# EAGLE design Micro_V6 (EAGLE 8.4.0)
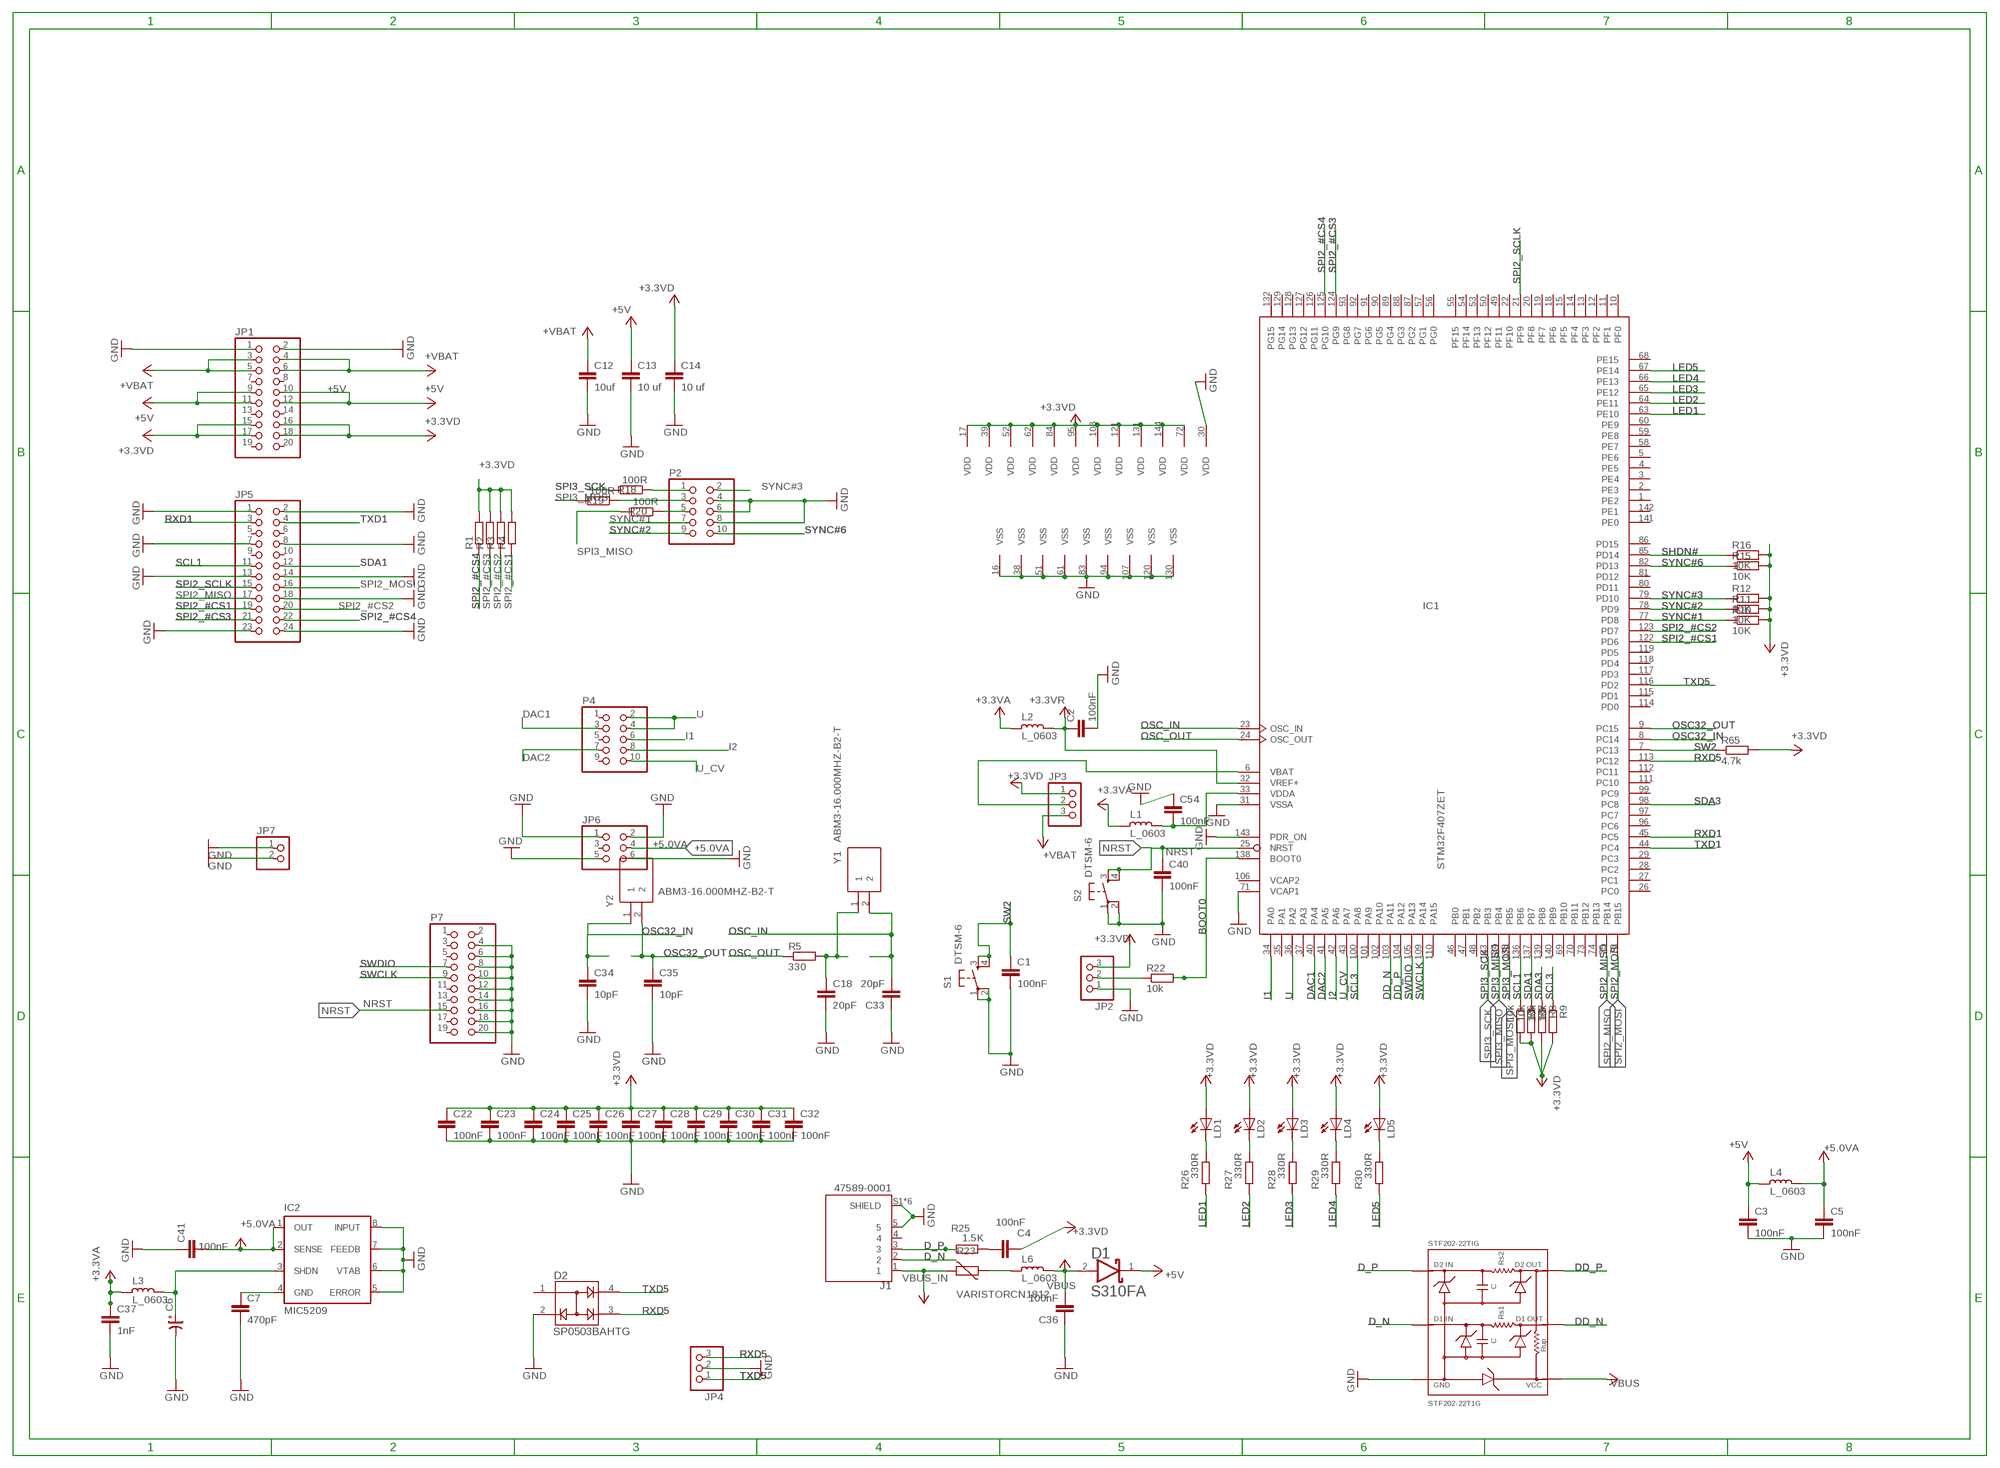
[diagram p0: schematic, sheet 1]

## Parts
C1  100nF  C-EUC0805  [C0805]
C2  100nF  C-EUC0805  [C0805]
C3  100nF  C-EUC0805  [C0805]
C4  100nF  C-EUC0805  [C0805]
C5  100nF  C-EUC0805  [C0805]
C6  CP_SV-A  [CSV-A]
C7  470pF  C-EUC0805  [C0805]
C12  10uf  C-EUC0805K  [C0805K]
C13  10 uf  C-EUC0805K  [C0805K]
C14  10 uf  C-EUC0805K  [C0805K]
C18  20pF  C-EUC0805  [C0805]
C22  100nF  C-EUC0805  [C0805]
C23  100nF  C-EUC0805  [C0805]
C24  100nF  C-EUC0805  [C0805]
C25  100nF  C-EUC0805  [C0805]
C26  100nF  C-EUC0805  [C0805]
C27  100nF  C-EUC0805  [C0805]
C28  100nF  C-EUC0805  [C0805]
C29  100nF  C-EUC0805  [C0805]
C30  100nF  C-EUC0805  [C0805]
C31  100nF  C-EUC0805  [C0805]
C32  100nF  C-EUC0805  [C0805]
C33  20pF  C-EUC0805  [C0805]
C34  10pF  C-EUC0805  [C0805]
C35  10pF  C-EUC0805  [C0805]
C36  100nF  C-EUC0805  [C0805]
C37  1nF  C-EUC0805  [C0805]
C40  100nF  C-EUC0805  [C0805]
C41  100nF  C-EUC0805  [C0805]
C54  100nF  C-EUC0805  [C0805]
D1  ON_SEMICONDUCTOR_S310FAON_SEMICONDUCTOR_S310FA_0_0  [ON_SEMICONDUCTOR_S310FA_0]
D2  SP0503BAHTG  [SOT143]
IC1  STM32F407ZET  [LQFP144]
IC2  MIC5209  LP2951ACM-3.3  [SO-08]
J1  47589-0001  [MOLEX_47589-0001]
JP1  PINHD-2X10  [2X10]
JP2  PINHD-1X3  [1X03]
JP3  PINHD-1X3  [1X03]
JP4  PINHD-1X3  [1X03]
JP5  PINHD-2X12  [2X12]
JP6  PINHD-2X3  [2X03]
JP7  PINHD-1X2  [1X02]
L1  L_0603  [L0603]
L2  L_0603  [L0603]
L3  L_0603  [L0603]
L4  L_0603  [L0603]
L6  L_0603  [L0603]
LD1  LEDSMT1206  [1206]
LD2  LEDSMT1206  [1206]
LD3  LEDSMT1206  [1206]
LD4  LEDSMT1206  [1206]
LD5  LEDSMT1206  [1206]
P2  PINHD-2X5  [2X05]
P4  PINHD-2X5  [2X05]
P7  PINHD-2X10  [2X10]
R1  R-EU_R0603  [R0603]
R2  R-EU_R0603  [R0603]
R3  R-EU_R0603  [R0603]
R4  R-EU_R0603  [R0603]
R5  330  R-EU_R0603  [R0603]
R6  10k  R-EU_R0603  [R0603]
R7  10k  R-EU_R0603  [R0603]
R8  10k  R-EU_R0603  [R0603]
R9  10k  R-EU_R0603  [R0603]
R10  10K  R-EU_R0603  [R0603]
R11  10K  R-EU_R0603  [R0603]
R12  10K  R-EU_R0603  [R0603]
R15  10K  R-EU_R0603  [R0603]
R16  10K  R-EU_R0603  [R0603]
R18  100R  R-EU_R0603  [R0603]
R19  100R  R-EU_R0603  [R0603]
R20  100R  R-EU_R0603  [R0603]
R22  10k  R-EU_R0603  [R0603]
R23  VARISTORCN1812  [CT/CN1812]
R25  1.5K  R-EU_R0603  [R0603]
R26  330R  R-EU_R0603  [R0603]
R27  330R  R-EU_R0603  [R0603]
R28  330R  R-EU_R0603  [R0603]
R29  330R  R-EU_R0603  [R0603]
R30  330R  R-EU_R0603  [R0603]
R65  4.7k  R-EU_R0603  [R0603]
S1  DTSM-6  [DTSM-6]
S2  DTSM-6  [DTSM-6]
STF202-22TIG  STF202-22T1G  [STF202-22T1G]
Y1  ABM3-16.000MHZ-B2-T  [ABM316000MHZB2T]
Y2  ABM3-16.000MHZ-B2-T  [ABM316000MHZB2T]

## Nets
+3.3VA: C37.1 L1.2 L2.2 L3.2
+3.3VD: C4.1 C14.1 C22.1 C23.1 C24.1 C25.1 C26.1 C27.1 C28.1 C29.1 C30.1 C31.1 C32.1 IC1.17(VDD) IC1.39(VDD) IC1.52(VDD) IC1.62(VDD) IC1.72(VDD) IC1.84(VDD) IC1.95(VDD) IC1.108(VDD) IC1.121(VDD) IC1.131(VDD) IC1.144(VDD) JP1.15 JP1.16 JP1.17 JP1.18 JP2.3 JP3.1 LD1.A LD2.A LD3.A LD4.A LD5.A R1.2 R2.2 R3.2 R4.2 R6.2 R7.2 R8.2 R9.2 R10.2 R11.2 R12.2 R15.2 R16.2 R65.2
+3.3VR: C2.1 IC1.32(VREF+) L2.1
+5.0VA: C5.1 C41.2 IC2.1(OUT) IC2.2(SENSE) JP6.4 L4.1
+5V: C3.1 C13.1 D1.1(CATHODE) JP1.9 JP1.10 JP1.11 JP1.12 L4.2
+VBAT: C12.1 JP1.3 JP1.4 JP1.5 JP1.6 JP3.3
BOOT0: IC1.138(BOOT0) R22.2
D_N: J1.2 STF202-22TIG.5(D1-OUT)
D_P: J1.3 R25.1 STF202-22TIG.4(D2-OUT)
DAC1: IC1.40(PA4) P4.3
DAC2: IC1.41(PA5) P4.7
DD_N: IC1.103(PA11) STF202-22TIG.2(D1-IN)
DD_P: IC1.104(PA12) STF202-22TIG.3(D2-IN)
GND: C1.2 C2.2 C3.2 C5.2 C6.- C7.2 C12.2 C13.2 C14.2 C18.2 C22.2 C23.2 C24.2 C25.2 C26.2 C27.2 C28.2 C29.2 C30.2 C31.2 C32.2 C33.1 C34.2 C35.2 C36.1 C37.2 C40.2 C41.1 C54.1 D2.2 IC1.16(VSS) IC1.30(VDD) IC1.31(VSSA) IC1.38(VSS) IC1.51(VSS) IC1.61(VSS) IC1.71(VCAP1) IC1.83(VSS) IC1.94(VSS) IC1.107(VSS) IC1.120(VSS) IC1.130(VSS) IC1.143(PDR_ON) IC2.5(ERROR) IC2.6(VTAB) IC2.7(FEEDB) IC2.8(INPUT) J1.5 J1.S1(SHIELD) J1.S2(SHIELD) J1.S3(SHIELD) J1.S4(SHIELD) J1.S5(SHIELD) J1.S6(SHIELD) JP1.1 JP1.2 JP2.1 JP4.2 JP5.1 JP5.2 JP5.7 JP5.8 JP5.13 JP5.14 JP5.18 JP5.23 JP5.24 JP6.1 JP6.2 JP6.5 JP6.6 JP7.1 JP7.2 P2.4 P2.6 P2.8 P7.4 P7.6 P7.8 P7.10 P7.12 P7.14 P7.16 P7.18 P7.20 S1.1 S1.2 S2.1 S2.2 STF202-22TIG.6(GND)
I1: IC1.34(PA0) P4.6
I2: IC1.42(PA6) P4.8
LED1: IC1.63(PE10) R26.1
LED2: IC1.64(PE11) R27.1
LED3: IC1.65(PE12) R28.1
LED4: IC1.66(PE13) R29.1
LED5: IC1.67(PE14) R30.1
N$1: IC1.6(VBAT) JP3.2
N$2: C54.2 IC1.33(VDDA) L1.1
N$3: P2.3 R19.1
N$4: P2.5 R20.1
N$5: L6.2 R23.1
N$9: P2.1 R18.1
N$15: C18.1 R5.2 Y1.1
N$19: JP2.2 R22.1
N$24: C6.+ IC2.3(SHDN) L3.1
N$26: C7.1 IC2.4(GND)
N$28: C4.2 R25.2
N$29: LD1.C R26.2
N$30: LD2.C R27.2
N$31: LD3.C R28.2
N$32: LD4.C R29.2
N$33: LD5.C R30.2
NRST: C40.1 IC1.25(NRST) P7.15 S2.3 S2.4
OSC32_IN: C34.1 IC1.8(PC14) Y2.1
OSC32_OUT: C35.1 IC1.9(PC15) Y2.2
OSC_IN: C33.2 IC1.23(OSC_IN) Y1.2
OSC_OUT: IC1.24(OSC_OUT) R5.1
RXD1: IC1.45(PC5) JP5.3
RXD5: D2.3 IC1.113(PC12) JP4.3
SCL1: IC1.136(PB6) JP5.11 R6.1
SCL3: IC1.100(PA8) R9.1
SDA1: IC1.137(PB7) JP5.12 R7.1
SDA3: IC1.98(PC8) R8.1
SHDN#: IC1.85(PD14) R16.1
SPI2_#CS1: IC1.122(PD6) JP5.19 R4.1
SPI2_#CS2: IC1.123(PD7) JP5.20 R3.1
SPI2_#CS3: IC1.124(PG9) JP5.21 R2.1
SPI2_#CS4: IC1.125(PG10) JP5.22 R1.1
SPI2_MISO: IC1.75(PB14) JP5.17
SPI2_MOSI: IC1.76(PB15) JP5.16
SPI2_SCLK: IC1.21(PF9) JP5.15
SPI3_MISO: IC1.134(PB4) R20.2
SPI3_MOSI: IC1.135(PB5) R19.2
SPI3_SCK: IC1.133(PB3) R18.2
SW2: C1.1 IC1.7(PC13) R65.1 S1.3 S1.4
SWCLK: IC1.109(PA14) P7.9
SWDIO: IC1.105(PA13) P7.7
SYNC#1: IC1.77(PD8) P2.7 R10.1
SYNC#2: IC1.78(PD9) P2.9 R11.1
SYNC#3: IC1.79(PD10) P2.2 R12.1
SYNC#6: IC1.82(PD13) P2.10 R15.1
TXD1: IC1.44(PC4) JP5.4
TXD5: D2.4 IC1.116(PD2) JP4.1
U: IC1.36(PA2) P4.2 P4.4
U_CV: IC1.43(PA7) P4.10
VBUS: C36.2 D1.2(ANODE) L6.1 STF202-22TIG.1(VCC)
VBUS_IN: J1.1 R23.2
Unconnected: D2.1 IC1.1(PE2) IC1.2(PE3) IC1.3(PE4) IC1.4(PE5) IC1.5(PE6) IC1.10(PF0) IC1.11(PF1) IC1.12(PF2) IC1.13(PF3) IC1.14(PF4) IC1.15(PF5) IC1.18(PF6) IC1.19(PF7) IC1.20(PF8) IC1.22(PF10) IC1.26(PC0) IC1.27(PC1) IC1.28(PC2) IC1.29(PC3) IC1.35(PA1) IC1.37(PA3) IC1.46(PB0) IC1.47(PB1) IC1.48(PB2) IC1.49(PF11) IC1.50(PF12) IC1.53(PF13) IC1.54(PF14) IC1.55(PF15) IC1.56(PG0) IC1.57(PG1) IC1.58(PE7) IC1.59(PE8) IC1.60(PE9) IC1.68(PE15) IC1.69(PB10) IC1.70(PB11) IC1.73(PB12) IC1.74(PB13) IC1.80(PD11) IC1.81(PD12) IC1.86(PD15) IC1.87(PG2) IC1.88(PG3) IC1.89(PG4) IC1.90(PG5) IC1.91(PG6) IC1.92(PG7) IC1.93(PG8) IC1.96(PC6) IC1.97(PC7) IC1.99(PC9) IC1.101(PA9) IC1.102(PA10) IC1.110(PA15) IC1.111(PC10) IC1.112(PC11) IC1.114(PD0) IC1.115(PD1) IC1.117(PD3) IC1.118(PD4) IC1.119(PD5) IC1.126(PG11) IC1.127(PG12) IC1.128(PG13) IC1.129(PG14) IC1.132(PG15) IC1.139(PB8) IC1.140(PB9) IC1.141(PE0) IC1.142(PE1) J1.4 JP1.7 JP1.8 JP1.13 JP1.14 JP1.19 JP1.20 JP5.5 JP5.6 JP5.9 JP5.10 JP6.3 P4.1 P4.5 P4.9 P7.1 P7.2 P7.3 P7.5 P7.11 P7.13 P7.17 P7.19

## Power pins joined to a net without a drawn wire
VCAP2: IC1.106(VCAP2)

## Library data of the parts
C1-C5 C7 C12-C14 C18 C22-C37 C40 C41 C54 = rcl:C-EU: CAPACITOR, European symbol; SPICEPREFIX: C
C6 = rc-master-smd:CP_: POLARIZED CAP
D1 = ON Semiconductor - S310FA:ON_SEMICONDUCTOR_S310FA: DIODE SCHOTTKY 100V 3A SOD123FA; AUTOMOTIVE: No; CAPACITANCE: 78pF; CENTROID_NOT_SPECIFIED: No; DATASHEET: https://www.onsemi.com/pub/Collateral/SS36FA-D.PDF; DEVICE_CLASS_L1: Discrete Semiconductors; DEVICE_CLASS_L2: Diodes; DEVICE_CLASS_L3: Schottky Diodes; DIGIKEY_DESCRIPTION: DIODE SCHOTTKY 100V 3A SOD123FA; DIGIKEY_PART_NUMBER: S310FACT-ND; FOOTPRINT_URL: https://www.onsemi.com/pub/Collateral/425AB.PDF; FOOTPRINT_VARIANT_NAME_0: Recommended_Land_Pattern; FORWARD_CURRENT: 3A; HEIGHT: 1.43mm; LEAD_FREE: Yes; MAX_JUNCTION_TEMP: +150°C; MAX_REPETITIVE_REVERSE_VOLTAGE: 100V; MAX_SURGE_FORWARD_CURRENT: 80A; MF: ON Semiconductor; MFG_PACKAGE_IDENT: 425AB; MFG_PACKAGE_IDENT_COMPONENT_ID: dabe0bdd8accd792; MFG_PACKAGE_IDENT_DATE: 08/2016; MFG_PACKAGE_IDENT_REV: O; MOUSER_DESCRIPTION: Schottky Diodes & Rectifiers 100V 3A Schottky Barrier Rectifier; MOUSER_PART_NUMBER: 512-S310FA; MPN: S310FA; PACKAGE: SOD-123FL; PEAK_REVERSE_CURRENT: 0.1mA; PREFIX: D; REVERSE_VOLTAGE: 100V; ROHS: Yes; TEMPERATURE_RANGE_HIGH: +150°C; TEMPERATURE_RANGE_LOW: -55°C; VERIFICATION_VERSION: 0.0.0.3
D2 = SP0503BAHTG:SP0503BAHTG: TVS DIODE 5.5VWM 8.5VC SOT143 Check prices <https://pricing.snapeda.com/parts/SP0503BAHTG/Littelfuse%20Inc./view-part?ref=eda>; AVAILABILITY: Warning; DESCRIPTION: 8.5V Clamp Ipp Tvs Diode Surface Mount SOT-143-4; MF: Littelfuse Inc.; MP: SP0503BAHTG; PACKAGE: SOT-143 Littelfuse; PRICE: None; PURCHASE-URL: https://pricing.snapeda.com/search/part/SP0503BAHTG/?ref=eda
IC1 = micro-stm_v3:STM32F407Z*T: ARM 32-bit Cortex™-M3 CPU 168 MHz maximum frequency 512 to 1024 Kbytes of Flash memory 192 kbytes of SRAM 114 GPIOs 1.8 to 3.6 V application supply
IC2 = v-reg:LP2951?*: Series of Adjustable Micropower Voltage Regulators Source: http://cache.national.com/ds/LP/LP2950.pdf
J1 = 47589-0001 (1):47589-0001: Stainless Steel Extractor for Camera Socket, 6.5x6.5 Type, Lead free Check prices <https://pricing.snapeda.com/parts/47589-0001/Molex/view-part?ref=eda>; AVAILABILITY: Warning; DESCRIPTION: USB - micro AB Receptacle Connector 5 Position Surface Mount, Right Angle; Through Hole; MF: Molex; MP: 47589-0001; PACKAGE: None; PRICE: None; PURCHASE-URL: https://pricing.snapeda.com/search/part/47589-0001/?ref=eda
JP1 P7 = pinhead:PINHD-2X10: PIN HEADER
JP2-JP4 = pinhead:PINHD-1X3: PIN HEADER
JP5 = pinhead:PINHD-2X12: PIN HEADER
JP6 = pinhead:PINHD-2X3: PIN HEADER
JP7 = pinhead:PINHD-1X2: PIN HEADER
L1-L4 L6 = rc-master-smd:L_: INDUCTOR
LD1-LD5 = led:LED: LED OSRAM: - CHIPLED LG R971, LG N971, LY N971, LG Q971, LY Q971, LO R971, LY R971 LH N974, LH R974 LS Q976, LO Q976, LY Q976 LO Q996 - Hyper CHIPLED LW Q18S LB Q993, LB Q99A, LB R99A - SideLED LS A670, LO A670, LY A670, LG A670, LP A670 LB A673, LV A673, LT A673, LW A673 LH A674 LY A675 LS A676, LA A676, LO A676, LY A676, LW A676 LS A679, LY A679, LG A679 - Hyper Micro SIDELED® LS Y876, LA Y876, LO Y876, LY Y876 LT Y87S - SmartLED LW L88C, LW L88S LB L89C, LB L89S, LG L890 LS L89K, LO L89K, LY L89K LS L896, LA L896, LO L896, LY L896 - TOPLED LS T670, LO T670, LY T670, LG T670, LP T670 LSG T670, LSP T670, LSY T670, LOP T670, LYG T670 LG T671, LOG T671, LSG T671 LB T673, LV T673, LT T673, LW T673 LH T674 LS T676, LA T676, LO T676, LY T676, LB T676, LH T676, LSB T676, LW T676 LB T67C, LV T67C, LT T67C, LS T67K, LO T67K, LY T67K, LW E67C LS E67B, LA E67B, LO E67B, LY E67B, LB E67C, LV E67C, LT E67C LW T67C LS T679, LY T679, LG T679 LS T770, LO T770, LY T770, LG T770, LP T770 LB T773, LV T773, LT T773, LW T773 LH T774 LS E675, LA E675, LY E675, LS T675 LS T776, LA T776, LO T776, LY T776, LB T776 LHGB T686 LT T68C, LB T68C - Hyper Mini TOPLED® LB M676 - Mini TOPLED Santana® LG M470 LS M47K, LO M47K, LY M47K Source: http://www.osram.convergy.de/
P2 P4 = pinhead:PINHD-2X5: PIN HEADER
R1-R12 R15 R16 R18-R20 R22 R25-R30 R65 = rcl:R-EU_: RESISTOR, European symbol; SPICEPREFIX: R
R23 = varistor:VARISTOR: VARISTOR
S1 S2 = switch-tact:DTSM-6
STF202-22TIG = STF202-22T1G (1):STF202-22T1G: Check prices <https://pricing.snapeda.com/parts/STF202-22T1G/ON%20Semiconductor/view-part?ref=eda>; AVAILABILITY: Warning; DESCRIPTION: RC (Pi) EMI Filter 2nd Order Low Pass 2 Channel R = 22Ohms, C = 68pF SC-74, SOT-457; MF: ON Semiconductor; MP: STF202-22T1G; PACKAGE: TSOP-6 ON Semiconductor; PRICE: None; PURCHASE-URL: https://pricing.snapeda.com/search/part/STF202-22T1G/?ref=eda
Y1 Y2 = ABM3-16.000MHZ-B2-T:ABM3-16.000MHZ-B2-T: ABRACON - ABM3-16.000MHZ-B2-T - CRYSTAL, 16MHZ, 18PF CL, 5X3.2MM, SMT Source: Datasheet <https://abracon.com/Resonators/abm3.pdf>; ARROW_PART_NUMBER: ABM3-16.000MHZ-B2-T; ARROW_PRICE-STOCK: https://www.arrow.com/en/products/abm3-16.000mhz-b2-t/abracon; DESCRIPTION: ABRACON - ABM3-16.000MHZ-B2-T - CRYSTAL, 16MHZ, 18PF CL, 5X3.2MM, SMT; HEIGHT: 1.3mm; MANUFACTURER_NAME: ABRACON; MANUFACTURER_PART_NUMBER: ABM3-16.000MHZ-B2-T; MOUSER_PART_NUMBER: 815-ABM3-16-B2-T; MOUSER_PRICE-STOCK: https://www.mouser.co.uk/ProductDetail/ABRACON/ABM3-16000MHZ-B2-T/?qs=H8AWquzS%2FlOF%252BStKHcxcSw%3D%3D

## Board
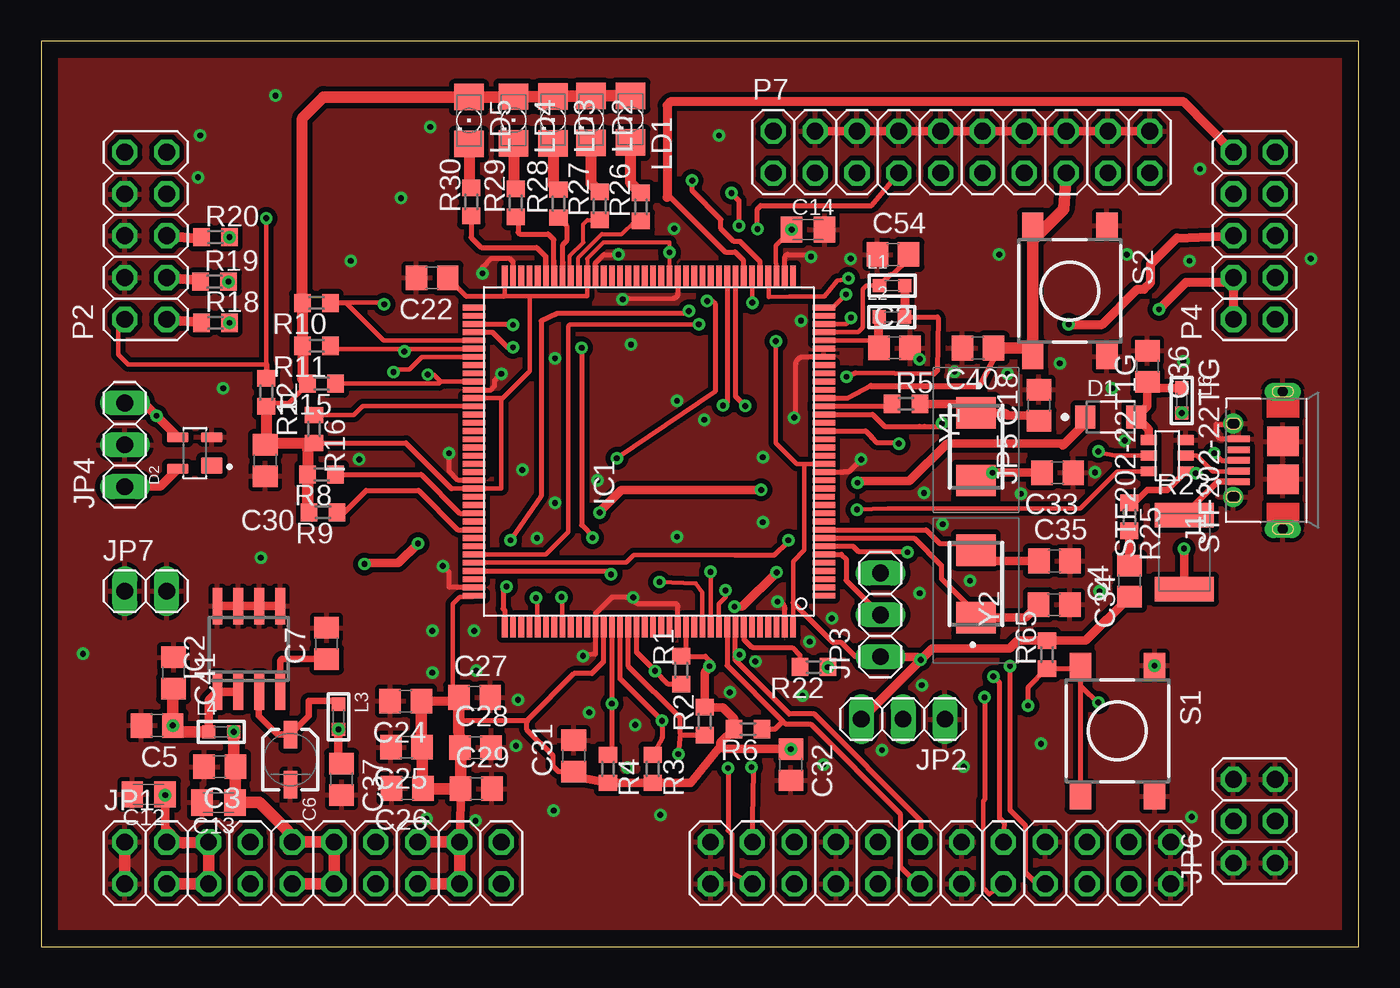
[diagram p1: board, top side]
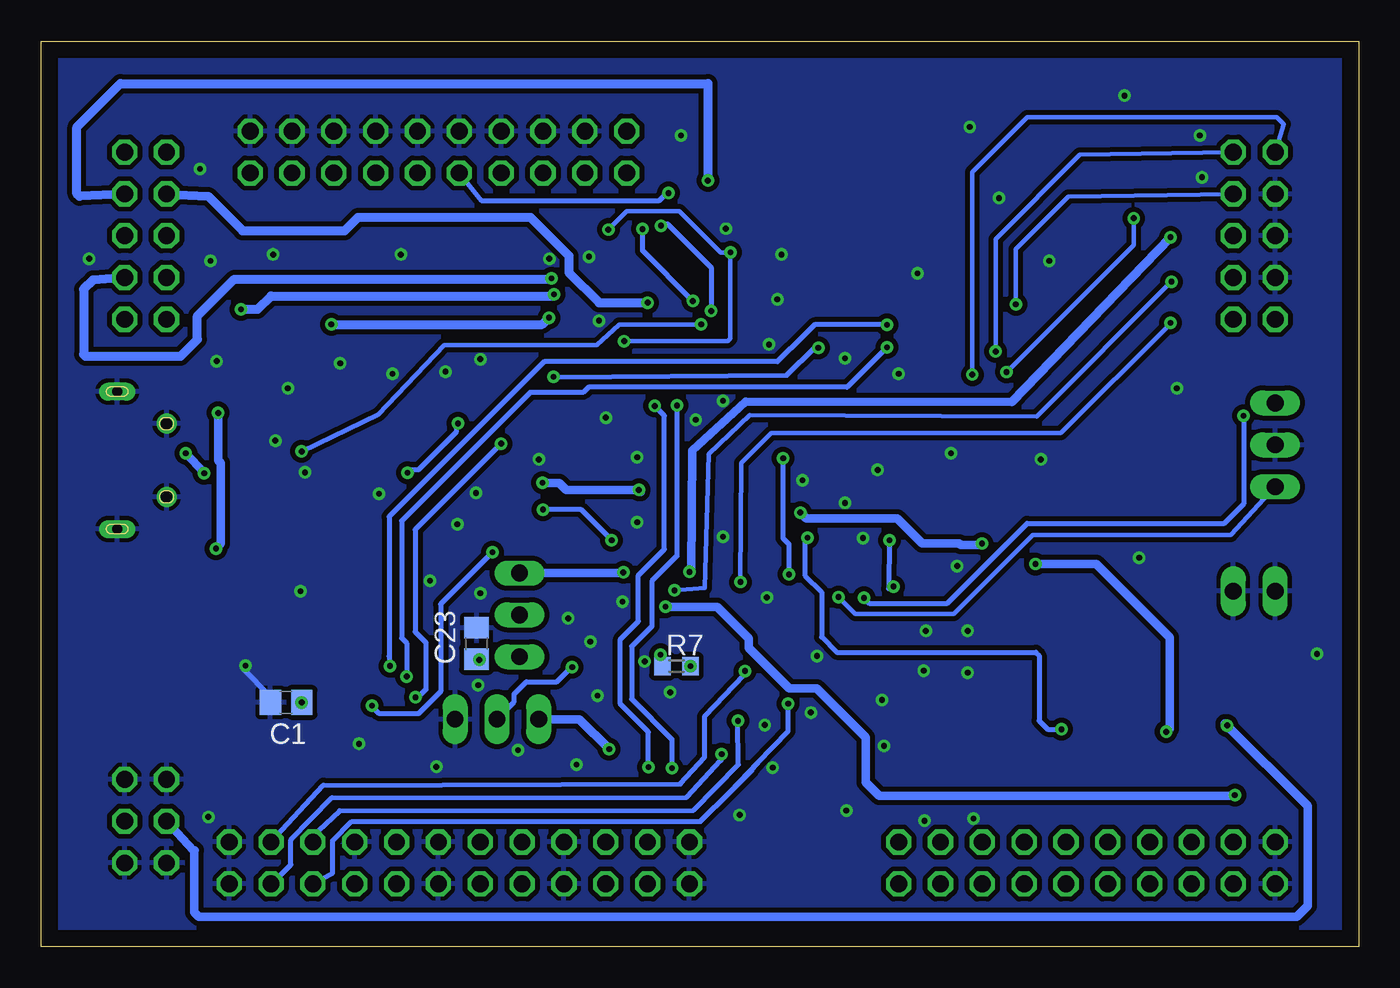
[diagram p2: board, bottom side, seen from below]

Size 80 x 55 mm. Coordinates in mm from the lower left corner, seen from the top.
Outline: 0,0 80,0 80,55 0,55 0,0
Copper layers (1*16): Top 0.035mm / dielectric 1.5mm / Bottom 0.035mm
Design rules "default": minimum track width 6mil, minimum drill 0.35mm, track to track 6mil, track to pad 6mil, pad to pad 6mil, via to via 6mil, smd to smd 6mil, copper to edge 40mil, drill to drill 6mil, minimum pad ring 10mil, minimum via ring 8mil, stop-mask expansion 4mil, vias tented up to drill 0mil, thermal gap 10mil

### Footprints (pad centres in the part's own frame; a part is rotated, then mirrored left to right if it is on the bottom)
C0805 = smd 1.3 x 1.5: 1 -0.95,0; 2 0.95,0
CSV-A = smd 1.676 x 0.813: + -1.524,0; - 1.524,0
C0805K = smd 1.3 x 1.6: 1 -1,0; 2 1,0
ON_SEMICONDUCTOR_S310FA_0 = smd 1.2 x 1.4: 1 -1.55,0; 2 1.55,0
SOT143 = smd 0.99 x 1.3: 1 -0.76,-1.025 | smd 0.59 x 1.3: 2 0.96,-1.025; 3 0.96,1.025; 4 -0.96,1.025
LQFP144 = smd 0.35 x 1.35: 1 -8.75,-10.625; 2 -8.25,-10.625; 3 -7.75,-10.625; 4 -7.25,-10.625; 5 -6.75,-10.625; 6 -6.25,-10.625; 7 -5.75,-10.625; 8 -5.25,-10.625; 9 -4.75,-10.625; 10 -4.25,-10.625; 11 -3.75,-10.625; 12 -3.25,-10.625; 13 -2.75,-10.62; 14 -2.25,-10.625; 15 -1.75,-10.625; 16 -1.25,-10.625; 17 -0.75,-10.625; 18 -0.25,-10.625; 19 0.25,-10.625; 20 0.75,-10.625; 21 1.25,-10.625; 22 1.75,-10.625; 23 2.25,-10.625; 24 2.75,-10.62; 25 3.25,-10.625; 26 3.75,-10.625; 27 4.25,-10.625; 28 4.75,-10.625; 29 5.25,-10.625; 30 5.75,-10.625; 31 6.25,-10.625; 32 6.75,-10.625; 33 7.25,-10.625; 34 7.75,-10.625; 35 8.25,-10.625; 36 8.75,-10.625; 73 8.75,10.625; 74 8.25,10.625; 75 7.75,10.625; 76 7.25,10.625; 77 6.75,10.625; 78 6.25,10.625; 79 5.75,10.625; 80 5.25,10.625; 81 4.75,10.625; 82 4.25,10.625; 83 3.75,10.625; 84 3.25,10.625; 85 2.75,10.625; 86 2.25,10.625; 87 1.75,10.625; 88 1.25,10.625; 89 0.75,10.625; 90 0.25,10.625; 91 -0.25,10.625; 92 -0.75,10.625; 93 -1.25,10.625; 94 -1.75,10.625; 95 -2.25,10.625; 96 -2.75,10.625; 97 -3.25,10.625; 98 -3.75,10.625; 99 -4.25,10.625; 100 -4.75,10.625; 101 -5.25,10.625; 102 -5.75,10.625; 103 -6.25,10.625; 104 -6.75,10.625; 105 -7.25,10.625; 106 -7.75,10.625; 107 -8.25,10.625; 108 -8.75,10.625 | smd 1.35 x 0.35: 37 10.625,-8.75; 38 10.625,-8.25; 39 10.625,-7.75; 40 10.625,-7.25; 41 10.625,-6.75; 42 10.625,-6.25; 43 10.625,-5.75; 44 10.625,-5.25; 45 10.625,-4.75; 46 10.625,-4.25; 47 10.625,-3.75; 48 10.625,-3.25; 49 10.625,-2.75; 50 10.625,-2.25; 51 10.625,-1.75; 52 10.625,-1.25; 53 10.625,-0.75; 54 10.625,-0.25; 55 10.625,0.25; 56 10.625,0.75; 57 10.625,1.25; 58 10.625,1.75; 59 10.625,2.25; 60 10.625,2.75; 61 10.625,3.25; 62 10.625,3.75; 63 10.625,4.25; 64 10.625,4.75; 65 10.625,5.25; 66 10.625,5.75; 67 10.625,6.25; 68 10.625,6.75; 69 10.625,7.25; 70 10.625,7.75; 71 10.625,8.25; 72 10.625,8.75; 109 -10.625,8.75; 110 -10.625,8.25; 111 -10.625,7.75; 112 -10.625,7.25; 113 -10.625,6.75; 114 -10.625,6.25; 115 -10.625,5.75; 116 -10.625,5.25; 117 -10.625,4.75; 118 -10.625,4.25; 119 -10.625,3.75; 120 -10.625,3.25; 121 -10.625,2.75; 122 -10.625,2.25; 123 -10.625,1.75; 124 -10.625,1.25; 125 -10.625,0.75; 126 -10.625,0.25; 127 -10.625,-0.25; 128 -10.625,-0.75; 129 -10.625,-1.25; 130 -10.625,-1.75; 131 -10.625,-2.25; 132 -10.625,-2.75; 133 -10.625,-3.25; 134 -10.625,-3.75; 135 -10.625,-4.25; 136 -10.625,-4.75; 137 -10.625,-5.25; 138 -10.625,-5.75; 139 -10.625,-6.25; 140 -10.625,-6.75; 141 -10.625,-7.25; 142 -10.625,-7.75; 143 -10.625,-8.25; 144 -10.625,-8.75
SO-08 = smd 0.6 x 2.2: 1 -1.905,-2.6; 2 -0.635,-2.6; 3 0.635,-2.6; 4 1.905,-2.6; 5 1.905,2.6; 6 0.635,2.6; 7 -0.635,2.6; 8 -1.905,2.6
MOLEX_47589-0001 = smd 0.4 x 1.35: 1 -1.3,1.938; 2 -0.65,1.938; 3 0,1.938; 4 0.65,1.938; 5 1.3,1.938 | drill 0.6 pad 0.95 long: S1 -4.175,-0.738; S4 4.175,-0.738 | smd 1.8 x 1.9: S2 -1.15,-0.738; S3 1.15,-0.738 | drill 0.7 pad 1.1: S5 -2.225,2.263; S6 2.225,2.263
2X10 = drill 1.016 octagon: 1 -11.43,-1.27; 2 -11.43,1.27; 3 -8.89,-1.27; 4 -8.89,1.27; 5 -6.35,-1.27; 6 -6.35,1.27; 7 -3.81,-1.27; 8 -3.81,1.27; 9 -1.27,-1.27; 10 -1.27,1.27; 11 1.27,-1.27; 12 1.27,1.27; 13 3.81,-1.27; 14 3.81,1.27; 15 6.35,-1.27; 16 6.35,1.27; 17 8.89,-1.27; 18 8.89,1.27; 19 11.43,-1.27; 20 11.43,1.27
1X03 = drill 1.016 long: 1 -2.54,0; 2 0,0; 3 2.54,0
2X12 = drill 1.016 octagon: 1 -13.97,-1.27; 2 -13.97,1.27; 3 -11.43,-1.27; 4 -11.43,1.27; 5 -8.89,-1.27; 6 -8.89,1.27; 7 -6.35,-1.27; 8 -6.35,1.27; 9 -3.81,-1.27; 10 -3.81,1.27; 11 -1.27,-1.27; 12 -1.27,1.27; 13 1.27,-1.27; 14 1.27,1.27; 15 3.81,-1.27; 16 3.81,1.27; 17 6.35,-1.27; 18 6.35,1.27; 19 8.89,-1.27; 20 8.89,1.27; 21 11.43,-1.27; 22 11.43,1.27; 23 13.97,-1.27; 24 13.97,1.27
2X03 = drill 1.016 octagon: 1 -2.54,-1.27; 2 -2.54,1.27; 3 0,-1.27; 4 0,1.27; 5 2.54,-1.27; 6 2.54,1.27
1X02 = drill 1.016 long: 1 -1.27,0; 2 1.27,0
L0603 = smd 0.8 x 0.8: 1 -0.762,0; 2 0.762,0
1206 = smd 1.6 x 1.803: A -1.422,0; C 1.422,0
2X05 = drill 1.016 octagon: 1 -5.08,-1.27; 2 -5.08,1.27; 3 -2.54,-1.27; 4 -2.54,1.27; 5 0,-1.27; 6 0,1.27; 7 2.54,-1.27; 8 2.54,1.27; 9 5.08,-1.27; 10 5.08,1.27
R0603 = smd 1 x 1.1: 1 -0.85,0; 2 0.85,0
CT/CN1812 = smd 1.5 x 3.6: 1 -2.25,0; 2 2.25,0
DTSM-6 = smd 1.55 x 1.3: 1 -3.975,2.25; 2 3.975,2.25; 3 -3.975,-2.25; 4 3.975,-2.25
STF202-22T1G = smd 0.6 x 0.95: 1 -0.95,-1.125; 2 0,-1.125; 3 0.95,-1.125; 4 0.95,1.125; 5 0,1.125; 6 -0.95,1.125
ABM316000MHZB2T = smd 1.9 x 2.4: 1 -2.05,0; 2 2.05,0

### Placement (x,y rotation side)
C1  65.13,14.83 180 bottom
C2  51.81,36.37 0 top
C3  10.84,10.93 180 top
C4  66.08,22.19 90 top
C5  7.04,13.43 180 top
C6  15.13,11.36 270 top
C7  17.33,18.41 90 top
C12  6.53,9.25 180 top
C13  10.77,8.75 180 top
C14  46.57,43.55 0 top
C18  60.58,32.88 90 top
C22  23.74,40.63 180 top
C23  53.57,18.41 90 bottom
C24  22.13,14.91 180 top
C25  22.18,12.11 180 top
C26  22.23,9.61 180 top
C27  26.31,15.14 0 top
C28  26.37,12.09 0 top
C29  26.42,9.59 0 top
C30  13.61,29.53 270 top
C31  32.33,11.58 90 top
C32  45.52,11.05 270 top
C33  61.71,28.78 180 top
C34  61.5,20.77 0 top
C35  61.52,23.43 0 top
C36  67.16,35.25 270 top
C37  18.24,10.16 270 top
C40  56.88,36.36 180 top
C41  8.04,16.63 270 top
C54  51.72,42.04 0 top
D1  64.94,32.17 0 top
D2  9.33,29.98 90 top
IC1  36.9,30.07 90 top
IC2  12.61,18.08 0 top
J1  74.65,29.54 90 top
JP1  16.51,5.08 0 top
JP2  52.33,13.82 180 top
JP3  50.95,20.15 90 top
JP4  5.08,30.48 90 top
JP5  54.61,5.08 0 top
JP6  73.66,7.62 90 top
JP7  6.35,21.59 0 top
L1  51.66,40.15 0 top
L2  51.65,38.25 0 top
L3  18.05,13.96 270 top
L4  10.93,13.05 0 top
L6  69.25,33.18 270 top
LD1  35.78,50.26 270 top
LD2  33.38,50.24 270 top
LD3  31.08,50.22 270 top
LD4  28.68,50.2 270 top
LD5  25.98,50.18 270 top
P2  6.35,43.18 90 top
P4  73.66,43.18 90 top
P7  55.88,48.26 0 top
R1  38.86,16.79 90 top
R2  40.28,13.69 90 top
R3  37.13,10.79 270 top
R4  34.42,10.79 270 top
R5  52.51,32.97 0 top
R6  42.91,13.21 180 top
R7  41.43,17.04 0 bottom
R8  17.03,28.68 180 top
R9  17.11,26.38 180 top
R10  16.71,39.1 180 top
R11  16.73,36.49 180 top
R12  13.66,33.66 270 top
R15  17.03,34.2 180 top
R16  16.56,31.44 270 top
R18  10.58,37.89 0 top
R19  10.53,40.39 0 top
R20  10.58,43.09 0 top
R22  46.91,16.98 180 top
R23  69.4,23.96 90 top
R25  66.07,26.1 270 top
R26  36.41,44.93 90 top
R27  33.91,44.98 90 top
R28  31.41,45.13 90 top
R29  28.81,45.18 90 top
R30  26.11,45.23 90 top
R65  61.07,17.74 90 top
S1  65.35,13.09 270 top
S2  62.45,39.83 270 top
STF202-22TIG  68.37,29.82 270 top
Y1  56.75,30.37 270 top
Y2  56.76,22.03 90 top

### Tracks (layer width: path | path; a pad name or v marks a point on that pad's centre or on a via)
+3.3VA  (via drill 0.35)
  Top 0.305: L2.2 54.41,38.25 54.46,38.2 54.41,34.98 54.2,34.77 49.45,34.85 v48.9,34.61 | v32.82,36.37 32.82,25.6 33.53,24.89 v33.48,24.84
  Top 0.508: L3.2 18.05,11.3 C37.1
  Top 0.559: L1.2 52.42,38.26 L2.2
  Bottom 0.305: 48.87,34.57 48.85,34.57 v48.9,34.61 34.73,34.71 33.02,36.37 v32.82,36.37 | v33.48,24.84 33.63,24.69 33.63,22.55 32.61,21.54 32.61,18.8 31.7,17.88 19.61,17.88 19.41,17.68 19.41,13.72 18.9,13.21 L3.2
  other vias: 18.05,13.2
+3.3VD  (via drill 0.35)
  Top 0.254: IC1.52 v38.15,42.16 38.15,42.77 34.14,42.77 33.15,41.79 IC1.62
  Top 0.279: R12.2 13.88,33.02 15.04,33.02 16.18,34.17 R15.2 | IC1.84 28.04,33.32 | 28.04,33.32 29.67,34.96 29.67,39.52 | IC1.72 28.15,39.52 29.67,39.52 | IC1.62 33.15,39.52 29.67,39.52 | 45.8,43.32 C14.1 44.6,42.59 44.6,41.51 44.62,41.49 44.62,40.79 44.68,40.73 IC1.39 | 28.04,33.32 27.94,33.22 27.94,27.84 27.92,27.82 IC1.95 24.91,27.82 | IC1.17 46.33,29.32 | 46.33,29.32 45.86,29.32 44.6,30.58 v44.6,36.78 | IC1.144 45.65,20.88 45.65,23.4 46.33,24.08 46.33,29.32 | IC1.108 26.19,21.23 25.4,21.23 24.99,20.83 24.99,15.47 C27.1
  Top 0.305: IC1.131 39.15,17.93 R1.2 40.32,17.64 40.77,17.2 40.77,17.18 R7.2 | R16.2 22.14,30.59 24.91,27.82 | C22.1 25.79,39.52 28.15,39.52 | IC1.121 34.13,19.43 34.13,17.29 33.43,16.59 32.34,16.59 29.53,13.78 | 29.53,13.78 29.46,13.72 | 29.46,13.72 25.37,13.72 | 29.53,13.67 29.53,13.78 | JP3.1 49.45,17.61 48.59,18.47 48.06,18.47 45.65,20.88 | 29.46,13.72 29.46,13.21 31.06,11.61 31.06,10.97 31.41,10.63 C31.1
  Top 0.508: R7.2 40.28,16.61 R2.2 40.3,14.53 41.38,14.53 42.06,13.84 R6.2 41.24,12.38 41.24,12.24 | 41.24,12.24 41.24,12.17 39.45,9.95 R3.2 R4.2 32.97,10.22 C31.1 | C32.1 41.48,12 41.24,12.24 | JP2.3 v53.4,17.42 | v53.4,17.42 54.09,18.11 58.8,18.11 59.28,18.59 R65.2 63.42,18.59 C4.1 | v53.4,17.42 53.2,17.61 JP3.1 | JP1.18 25.48,8.84 C29.1
  Top 0.559: C24.1 25.19,14.91 C27.1
  Top 0.66: 17.13,51.6 15.86,50.33 R10.2 15.86,36.51 R11.2 15.88,34.5 R15.2 | R12.2 13.66,30.54 C30.1 13.72,30.59 R16.2 16.18,30.21 R8.2
  Top 0.711: 17.13,51.6 LD5.A 28.66,51.6 LD4.A 31.06,51.62 LD3.A 33.36,51.64 LD2.A 33.4,51.68 LD1.A | R10.2 15.92,39.04 | 16.12,28.74 R8.2 16.18,26.46 R9.2 | JP1.15 JP1.17 JP1.18 JP1.16 | C24.1 23.08,12.16 C25.1 23.13,9.66 C26.1 23.2,9.59 C29.1 25.47,12.04 C28.1 25.37,12.14 25.37,13.72 C27.1
  Bottom 0.279: v38.15,42.16 38.74,42.16 41.25,44.67 44.45,44.67 C14.1 | v38.15,42.16 38.1,42.16 | v44.6,36.78 38.3,36.78 38.15,36.93 v38.15,42.16
  Bottom 0.508: C32.1 47.33,13.82 JP2.3 | C23.1 53.52,17.42 v53.4,17.42
  other vias: 45.57,43.55 40.58,17.04 45.52,12
+3.3VR
  Top 0.279: IC1.32 50.8,36.82 50.86,36.88
  Top 0.559: C2.1 50.86,36.88 50.86,38.22 L2.1
+5.0VA  (via drill 0.35)
  Top 0.508: IC2.2 IC2.1 10.17,14.94 L4.1
  Top 0.711: L4.1 8.37,13.05 C5.1 7.99,15.63 C41.2
  Bottom 0.508: JP6.4 70.78,5.84 70.69,5.84 70.71,5.82 70.71,2.08 70.43,1.8 3.76,1.8 3.1,2.46 3.1,8.53 8.13,13.56 8.12,13.56 C5.1
  other vias: 7.99,13.43
+5V  (via drill 0.35)
  Top 0.305: 62.17,30.57 arc90 62.2,30.61
  Top 0.508: D1.1 63.39,31.79 62.2,30.61 62.03,30.43 | 62.17,30.57 55,30.57 52.7,28.27 49.53,28.27 49.48,28.22 49.51,28.22 v49.55,28.17 | v43.71,27.74 35.23,27.74 33.91,26.42 v33.91,26.36 | v22.89,24.49 21.69,23.29 19.53,23.29 19.58,23.24 v19.63,23.24
  Top 0.711: L4.2 11.69,11.03 C3.1 11.79,8.77 C13.1 13.25,8.75 15,7 15,5.92 JP1.10 JP1.12 JP1.11 JP1.9
  Bottom 0.508: v49.55,28.17 48.54,28.17 48.11,27.74 43.84,27.74 | 43.84,27.74 v43.71,27.74 43.59,27.61 43.71,27.61 43.84,27.74 | v33.91,26.36 33.55,26.01 28.02,26.01 26.49,24.49 24.26,24.49 24.18,24.41 22.89,24.41 v22.89,24.49 | v19.63,23.24 15.95,23.24 11.48,18.77 11.48,13.23 11.68,13.03 L4.2
  other vias: 11.69,13.05
+VBAT  (via drill 0.35)
  Top 0.508: C12.1 v7.53,9.2 7.53,7.2 8.33,6.4 8.64,6.31 | v44.65,22.73 42.57,20.65 42.14,20.65 v42.09,20.65
  Top 0.711: JP1.3 JP1.5 JP1.6 8.64,6.31 JP1.4 | 7.19,8.91 C12.1
  Bottom 0.508: JP3.3 44.64,22.69 | 44.64,22.69 44.63,22.68 | 44.64,22.69 44.65,22.71 v44.65,22.73 | v42.09,20.65 42.06,20.62 38.94,20.62 37.03,18.72 37.03,18.14 34.57,15.67 32.92,15.67 29.95,12.7 29.95,9.98 29.11,9.14 7.57,9.14 v7.53,9.18 v7.53,9.2
BOOT0
  Top 0.305: IC1.138 42.67,19.43 42.67,18.64 42.85,18.46 43.11,18.21 43.16,18.21 43.21,18.16 45.59,18.16 46.06,17.7 R22.2
D_N
  Top 0.279: STF202-22TIG.5 70.15,29.82 71.12,28.85 72.68,28.85 J1.2
D_P  (via drill 0.35)
  Top 0.305: v71.22,29.97 71.65,29.54 J1.3
  Top 0.406: STF202-22TIG.4 68.36,27.74 67.16,27.74 66.37,26.95 R25.1
  Top 0.508: STF202-22TIG.4 69.89,28.87 70,28.75 v70.1,28.75
  Bottom 0.508: v70.1,28.75 v71.22,29.97
DAC1  (via drill 0.35)
  Top 0.279: IC1.40 44.17,39.47 45.41,39.47 47.55,39.47 48.34,40.46 48.97,40.54 v49.02,40.59
  Bottom 0.559: P4.3 76.85,40.5 77.42,39.93 77.42,35.97 77.32,35.87 71.53,35.87 70.51,36.88 70.51,38.3 68.28,40.54 49.07,40.54 v49.02,40.59
DAC2  (via drill 0.35)
  Top 0.305: IC1.41 43.65,41.62 42.44,42.82 42.06,42.82 41.27,43.61 41.27,44.17 39.52,45.92 v39.52,46.53
  Bottom 0.559: P4.7 77.69,45.58 77.83,45.72 77.83,49.78 75.18,52.43 39.52,52.43 v39.52,46.53
DD_N  (via drill 0.35)
  Top 0.279: STF202-22TIG.2 65.18,29.82 64.39,29.97 v64.19,30.07 | v39.93,37.8 32.11,37.8 32,37.69 32,25.2 30.63,23.82 IC1.103
  Bottom 0.279: v64.19,30.07 59.54,32.31 55.52,36.55 46.28,36.55 44.91,37.8 v39.93,37.8
DD_P  (via drill 0.35)
  Top 0.279: IC1.104 35.51,23.32 35.97,23.77 42.11,23.77 42.98,23.77 | v49.53,26.54 51.41,26.62 63.09,26.62 65.34,28.87 STF202-22TIG.3
  Top 0.305: 42.11,23.77 44.5,23.77 45.31,24.59 45.31,24.64 v45.36,24.69
  Bottom 0.305: v45.36,24.69 47.22,26.54 v49.53,26.54
GND  (via drill 0.35)
  Top 0.305: IC1.71 28.65,41.58 28.45,41.78 27.3,41.78 26.8,41.27 v26.8,40.89 | IC1.61 33.65,41.52 34.16,42.04 v35.05,42.04 | v32.89,17.65 33.65,17.77 IC1.120 33.67,19.46 33.67,20.25 34.63,21.21 v35.94,21.21 arc90 36.32,20.83 38.48,20.83 arc-90 38.65,20.66 IC1.130 | IC1.38 45.15,41.85 arc-90 45.34,42.04 46.61,42.04 arc-90 v46.74,41.91 | IC1.51 38.65,39.67 arc-90 38.35,39.37 v35.31,39.32 | IC1.30 46.28,35.82 arc90 45.8,35.33 45.8,32.21 arc-90 v45.72,32.13 | IC1.143 45.15,20.51 arc90 v44.7,20.95 | IC1.16 48.71,28.82 48.74,28.85 49.05,28.85 v49.78,29.59 | IC1.107 24.77,21.82 24.77,22.73 v24.38,23.11 | IC1.83 27.32,33.82 27.53,34.04 27.53,34.39 v27.94,34.8 | IC1.94 25.32,28.32 24.77,28.88 v24.77,29.97 | J1.5 71.6,30.84 71.35,31.09 71.35,31.7 71.32,31.73 72.35,31.73 J1.S6 | C2.2 53.34,35.79 v53.34,35.69
  Top 0.508: IC2.8 IC2.7 IC2.6 IC2.5 | P7.4 P7.6 P7.8 P7.10 P7.12 P7.14 P7.16 P7.18 P7.20
  Top 0.711: JP1.2 JP1.1
  Bottom 0.305: C1.2 66.08,15.21 67.74,16.87 67.6,17.01 S1.1
  other vias: 67.6,17.07 2.54,17.78 19.3,29.59 29.21,28.96 33.78,28.32 38.61,24.89 43.81,25.78 43.81,29.72 40.26,32 35.81,36.58 18.8,41.66 53.59,27.56 48.01,19.94 53.34,21.46 54.74,25.65 56.39,22.23 46.23,15.24 47.5,11.05 51.05,11.94 36.07,13.46 33.27,14.22 26.29,19.18 23.75,19.18 23.75,16.64 26.42,16.76 13.34,23.62 11.05,33.91 9.53,46.74 9.65,49.28 21.84,45.47 23.62,49.78 14.22,51.69 41.15,49.28 38.43,43.61 38.61,33.15 28.96,14.99 28.83,12.19 31.11,8.26 37.59,8 69.85,7.87 60.71,12.32 53.47,15.88 56.01,10.92 64.26,21.59 69.34,35.56 65.02,33.91 65.79,30.73 61.85,35.43 58.67,34.8 65.91,42.04 69.72,41.66 77.09,41.78 58.17,42.04 70.36,47.24 49.15,41.78 46.66,18.52 26.37,7.65 23.39,7.77 31.19,26.95 30.1,24.82 63.98,28.8 59.49,27.51 46.13,38.02 31.19,35.74 35.59,10.87 55.45,34.92 43.36,17.32 41.81,15.44
  pour Top (isolate 0.305): 0,0 80,0 80,55 0,55
  pour Bottom (isolate 0.305): 0,0 80,0 80,55 0,55
I1  (via drill 0.35)
  Top 0.279: v49.17,38.2 48.97,38 48.97,37.9 48.89,37.82 IC1.34
  Top 0.559: v62.38,37.8 64.41,37.8 66.55,39.93 66.95,39.93 67.36,40.34 67.36,41.45 68.95,43.04 P4.6
  Bottom 0.279: v62.38,37.8 62.48,37.8
  Bottom 0.559: v62.38,37.8 49.58,37.8 v49.17,38.2
I2  (via drill 0.35)
  Top 0.279: v43.18,39.12 43.18,40.66 IC1.42
  Bottom 0.559: P4.8 69.86,45.58 67.77,43.48 61.57,43.48 60.76,44.3 50.29,44.3 47.95,41.96 47.95,40.95 46.13,39.12 v43.18,39.12
LED1
  Top 0.254: IC1.63 32.61,40.73 32.61,41.86 34.04,43.28 35.26,43.28 36.05,44.08 R26.1
LED2
  Top 0.254: IC1.64 32.11,40.74 32.11,41.96 32.92,42.77 32.92,43.89 33.16,44.13 R27.1
LED3
  Top 0.305: R28.1 31.9,43.79 31.9,42.88 31.67,42.64 31.67,41.55 | 31.67,41.55 31.67,41.25 | IC1.65 31.67,41.55
LED4
  Top 0.305: R29.1 28.96,44.18 28.96,43.38 29.06,43.28 30.79,43.28 31.13,42.94 31.13,41.66 | 31.13,41.66 31.13,41.35 | IC1.66 31.13,41.66
LED5
  Top 0.305: R30.1 26.11,43.08 26.72,42.47 30.07,42.47 30.63,41.91 | 30.63,41.91 30.63,41.25 | IC1.67 30.65,41.89 arc90 30.63,41.91
N$1
  Top 0.305: IC1.6 48.59,23.82 48.87,23.55 48.87,22.25 50.95,20.17 JP3.2
N$2
  Top 0.279: IC1.33 49.61,37.32 49.89,37.59 49.89,39.93 50.11,40.15 L1.1
  Top 0.305: L1.1 51.59,40.84 51.71,40.84 52.67,41.8 C54.2
N$3
  Top 0.61: P2.3 9.6,40.47 R19.1
N$4
  Top 0.61: P2.5 9.65,43.01 R20.1
N$5  (via drill 0.35)
  Top 0.508: v69.39,24.18 R23.1
  Bottom 0.508: L6.2 69.25,29.53 69.09,29.36 69.09,24.49 v69.39,24.18
  other vias: 69.25,32.42
N$9
  Top 0.61: P2.1 9.69,37.93 R18.1
N$15
  Top 0.508: R5.2 56.2,32.97 Y1.1 58.54,32.42 58.7,32.26 60.25,32.26 C18.1
N$19  (via drill 0.35)
  Bottom 0.305: JP2.2 51.28,14.87 51.28,15.34 50.55,16.08 48.69,16.08 47.88,16.89 47.84,16.89 R22.1
  other vias: 47.76,16.98
N$24
  Top 0.406: IC2.3 13.21,15.44 13.21,14.02 14.35,12.88 C6.+ 16.26,14.01 16.26,14.94 17.84,14.94 L3.1
N$26
  Top 0.406: C7.1 14.62,17.46 14.52,17.36 IC2.4
N$28
  Top 0.508: R25.2 C4.2
N$29
  Top 0.66: LD1.C 35.78,46.41 R26.2
N$30
  Top 0.66: LD2.C 33.38,46.36 R27.2
N$31
  Top 0.66: LD3.C 31.08,46.31 R28.2
N$32
  Top 0.66: LD4.C 28.68,46.16 R29.2
N$33
  Top 0.66: LD5.C 25.98,46.21 R30.2
NRST
  Top 0.305: IC1.25 48.97,33.32 50.39,34.09 50.37,34.06 | S2.4 60.2,37.13
  Top 0.356: 50.37,34.06 56.97,34.06 57.83,35.68 C40.1
  Top 0.711: P7.15 62.08,44.81 60.2,42.93 S2.3 60.2,37.13 60.2,36.37 60.19,36.36 C40.1
OSC32_IN
  Top 0.305: 58.35,19.84 Y2.1 56.76,20.26 54.66,22.35 54.66,23.16 53.01,24.82 IC1.8
  Top 0.508: C34.1 59.77,19.98 Y2.1
OSC32_OUT
  Top 0.305: IC1.9 53.73,25.32 54.56,24.49 56.35,24.49 Y2.2
  Top 0.508: Y2.2 57.41,23.43 C35.1
OSC_IN  (via drill 0.35)
  Top 0.305: IC1.23 50.48,32.32 51.21,31.6 53.34,31.6 | 53.34,31.6 53.65,31.6 | 56.69,28.55 56.75,28.49 Y1.2 | 53.34,31.6 54.66,31.6 54.69,31.57 v54.69,31.77
  Top 0.508: C33.2 v57.76,28.78 56.93,28.78 56.69,28.55
  Bottom 0.305: v54.69,31.77 54.81,31.65 54.81,31.24 57.1,28.96 57.59,28.96 v57.76,28.78
OSC_OUT
  Top 0.305: IC1.24 51.51,32.82
  Top 0.356: 51.51,32.82 R5.1
RXD1  (via drill 0.35)
  Top 0.305: IC1.45 41.65,33.01 41.5,32.87 v41.4,32.87 | v41.71,10.85 41.71,7.06 41.94,6.83 41.94,4.51 JP5.3
  Bottom 0.305: v41.4,32.87 41.4,23.72 42.93,22.2 42.93,19.46 44.15,18.24 44.15,15.04 41.71,12.6 v41.71,10.85 41.71,10.82
RXD5  (via drill 0.35)
  Top 0.279: v30.05,21.18 30.07,21.34 IC1.113
  Top 0.508: D2.3 v7,32.25 6.18,33.06 JP4.3
  Bottom 0.305: v30.05,21.18 29.72,20.85 24.99,20.85 20.14,25.7 8.18,25.7 6.96,26.92 6.96,32.13 7.01,32.18 7,32.19 v7,32.25
SCL1
  Top 0.305: IC1.136 41.65,17.07 45.03,13.69 | 45.03,13.69 45.21,13.51 46.71,13.51 52.15,8.08 52.15,4.85 53.42,3.58 JP5.11 | 45.03,13.69 44.55,13.21 R6.1
SCL3
  Top 0.279: IC1.100 26.25,25.3
  Top 0.305: R9.1 18.4,26.38 19.74,27.71 22.91,27.71 25.3,25.32 IC1.100
SDA1  (via drill 0.35)
  Top 0.305: JP5.12 53.44,5.75 53.44,7.62 46.94,14.12 45.41,14.12 42.16,17.37 | IC1.137 42.15,17.39 42.16,17.37 | v42.39,17.73 42.16,17.37
  Bottom 0.305: R7.1 42.28,17.16 v42.39,17.73
SDA3
  Top 0.279: IC1.98
  Top 0.305: R8.1 23.06,28.68 25.43,26.31 IC1.98
SHDN#
  Top 0.279: IC1.85 19.51,32.82 18.98,32.29 R16.1
SPI2_#CS1  (via drill 0.35)
  Top 0.305: IC1.122 34.65,14.56 v34.65,14.76 34.65,11.97 R4.1
  Bottom 0.305: JP5.19 62.31,4.46 62.31,6.43 61.14,7.59 39.98,7.59 38.16,9.41 | 38.16,9.41 36.8,10.77 | 36.49,11.14 37.9,9.68 | 36.49,11.14 34.65,13.08 v34.65,14.76 | 38.16,9.41 36.49,11.14
SPI2_#CS2  (via drill 0.35)
  Top 0.305: IC1.123 35.15,16.26 v37.69,13.72 37.69,12.69 R3.1
  Bottom 0.305: JP5.20 63.58,5.73 63.58,6.66 61.87,8.26 40.39,8.28 37.67,11.05 v37.69,13.72
SPI2_#CS3  (via drill 0.35)
  Top 0.305: 38.79,12.95 v38.68,11.68 | 38.79,12.95 38.79,13.89 35.65,17.03 IC1.124 | R2.1 38.9,12.84 38.79,12.95
  Bottom 0.305: JP5.21 66.12,3.71 64.85,4.98 64.85,6.48 62.36,9.04 40.79,9.07 38.73,11.3 38.76,11.73 38.79,11.76 v38.68,11.68
SPI2_#CS4  (via drill 0.35)
  Top 0.305: IC1.125 36.15,17.86 v37.27,16.74 38.07,15.94 R1.1
  Bottom 0.305: JP5.22 66.12,6.27 62.87,9.8 41.2,9.88 39.73,11.51 39.73,13.97 37.31,16.51 37.36,16.51 37.27,16.6 v37.27,16.74
SPI2_MISO  (via drill 0.35)
  Top 0.305: IC1.75 28.75,37.82 28.78,37.8 28.68,37.8 v28.65,37.77 | v58.83,17.04 58.83,8.28 59.77,7.34 59.77,4.47 61.04,3.2 JP5.17
  Bottom 0.305: v28.65,37.77 33.05,37.77 34.49,36.32 34.52,36.32 35.31,35.53 49.45,35.53 58.88,26.11 58.88,17.65 v58.83,17.04
SPI2_MOSI  (via drill 0.35)
  Top 0.305: IC1.76 27.4,37.32 28.32,36.4 v28.65,36.4 | JP5.16 58.5,7.49 58.19,7.8 58.19,16.03 v57.81,16.41
  Bottom 0.305: v28.65,36.4 31.06,33.98 46.76,33.98 47.09,33.66 50.32,33.66 58.12,25.86 58.12,18.75 57.81,18.44 v57.81,16.41 | v57.81,16.41 57.81,16.23 57.86,16.18 57.86,16.36 v57.81,16.41
SPI2_SCLK  (via drill 0.35)
  Top 0.279: JP5.15 57.57,3.19 57.2,3.56 57.2,8.84
  Top 0.305: IC1.21 50.06,31.32 50.42,30.96 50.42,30.91 50.7,30.63 52.07,30.63 v52.07,30.56 | v57.28,15.14 57.28,8.91 57.2,8.84
  Bottom 0.305: v52.07,30.56 57.3,25.32 57.3,19.13 56.64,18.47 56.64,15.62 57.12,15.14 v57.28,15.14
SPI3_MISO  (via drill 0.35)
  Top 0.279: v40.64,22.76 IC1.134
  Bottom 0.508: R20.2 21.07,33.07 37.24,33.12 40.46,30.12 40.54,22.76 v40.64,22.76
  other vias: 11.43,43.09
SPI3_MOSI  (via drill 0.35)
  Top 0.279: v41.55,21.64 41.55,21.23 41.15,20.83 IC1.135
  Bottom 0.279: R19.2 19.56,32.21 36.98,32.28 39.47,29.92 39.73,21.79 v41.55,21.64
  other vias: 11.38,40.39
SPI3_SCK  (via drill 0.35)
  Top 0.279: v37.54,22.15 39.75,22.05 40.15,21.52 IC1.133
  Bottom 0.279: R18.2 11.48,37.84 11.48,37.8 18.09,31.19 35.66,31.19 37.49,29.36 v37.54,22.15
  other vias: 11.43,37.89
SW2  (via drill 0.35)
  Top 0.305: IC1.7 49.29,24.32 49.61,24 52.43,24 52.48,23.95 v52.6,23.95 | v59.92,14.63 59.92,15.74 R65.1 62.92,16.89 S1.3 | S1.3 S1.4 | S1.3 63.1,15.87 64.26,14.71 64.18,14.79 C1.1
  Bottom 0.305: v52.6,23.95 55.75,20.8 55.75,15.49 57.1,14.15 59.46,14.15 59.77,14.45 59.77,14.48 v59.92,14.63
  other vias: 64.18,14.83
SWCLK  (via drill 0.35)
  Top 0.305: v42.37,43.79 42.37,45.31 v41.91,45.77 | v39.32,38.61 39.42,38.51 39.52,38.61 39.17,38.46 31.32,38.46 30.35,38 30.35,27.36 v28.5,24.69 | v28.25,21.87 28.04,21.67 28.04,20.52 28.15,20.41 IC1.109
  Bottom 0.305: P7.9 53.27,45.32 42.47,45.32 41.96,45.82 v41.91,45.77 | v42.37,43.79 42.37,43.89 41.96,43.89 39.32,41.25 v39.32,38.61 | v28.5,24.69 28.55,21.74 v28.25,21.87
SWDIO  (via drill 0.35)
  Top 0.305: IC1.105 34.48,22.82 34.65,22.66 v34.59,22.61 | 35.05,29.77 v34.95,29.67 40.95,33.76 40.95,39.01 40.74,39.22 v40.44,39.22 | v43.48,43.59 43.48,44.81 43.69,45.01 50.42,45.01 P7.7
  Bottom 0.305: v34.59,22.61 34.59,24.43 34.95,24.79 v34.95,29.67 | v40.44,39.22 43.48,42.27 v43.48,43.59
SYNC#1  (via drill 0.35)
  Top 0.279: IC1.77 20.79,36.82 18.51,39.1 R10.1 17.58,39.12 20.83,39.12 v20.83,39.01
  Bottom 0.279: P2.7 17.64,45.55 20.83,42.37 v20.83,39.01
SYNC#2  (via drill 0.35)
  Top 0.279: IC1.78 26.24,36.29 22,36.29 17.78,36.29 R11.1
  Top 0.305: v22.05,36.15 22.05,36.24 22,36.29
  Bottom 0.279: P2.9 16.93,48.09 22.05,42.98 v22.05,36.15
SYNC#3  (via drill 0.35)
  Top 0.279: P2.2 4.67,37.81 4.67,35.97 5.28,35.36 13.72,35.36 13.72,34.56 R12.1 13.66,44.14 13.72,44.2 v13.66,44.25 | v21.39,34.9 21.54,35.05 22.35,35.05 23.12,35.82 IC1.79
  Bottom 0.279: 21.54,34.75 v21.39,34.9 13.66,42.62 v13.66,44.25
SYNC#6  (via drill 0.35)
  Top 0.279: 18,34.32 R15.1 24.14,34.2 24.26,34.32 | 24.26,34.32 IC1.82 | v23.47,34.75 23.83,34.75 24.26,34.32
  Bottom 0.279: P2.10 4.55,49.97 4.98,50.39 20.12,50.39 23.47,47.04 v23.47,34.75
TXD1  (via drill 0.35)
  Top 0.305: JP5.4 43.26,10.64 43.08,10.82 43.08,10.85 v43.13,10.9 | IC1.44 42.15,33.44 v42.75,32.84
  Bottom 0.305: v43.13,10.9 43.13,13.03 44.83,14.73 44.83,18.67 43.74,19.76 43.74,22.55 42.16,24.13 42.16,32.26 v42.75,32.84 42.8,32.89
TXD5  (via drill 0.35)
  Top 0.279: v31.6,21.23 31.65,21.18 IC1.116
  Top 0.508: D2.4 7.22,27.94 JP4.1 4.82,27.94
  Bottom 0.279: JP4.1 7.77,24.99 19.81,24.99 24.59,20.22 30.58,20.22 v31.6,21.23
U  (via drill 0.35)
  Top 0.279: 68.17,38.81 67.97,38.81 v67.87,38.71 | v48.87,39.62 48.07,38.82 IC1.36
  Top 0.559: P4.2 P4.4 72.39,40.34 69.49,40.34 67.97,38.81
  Bottom 0.559: v67.87,38.71 66.85,38.71 66.04,39.52 48.97,39.52 v48.87,39.62
U_CV
  Top 0.279: 42.67,40.72 IC1.43
  Top 0.305: IC1.43 42.65,41.68 42.14,42.19 41.53,42.19 38.2,45.52 38,45.52
  Top 0.559: P4.10 69.36,51.31 38.2,51.31 38,51.1 38,45.52
VBUS
  Top 0.508: 67.19,30.82 STF202-22TIG.1 67.25,31.41 D1.2 67.16,32.84 C36.2 67.52,33.94 L6.1
VBUS_IN
  Top 0.406: J1.1 71.43,28.24 R23.2